# Altium schematic sheet P15_4G_5G_NVME.SchDoc
size 594 x 420 mm
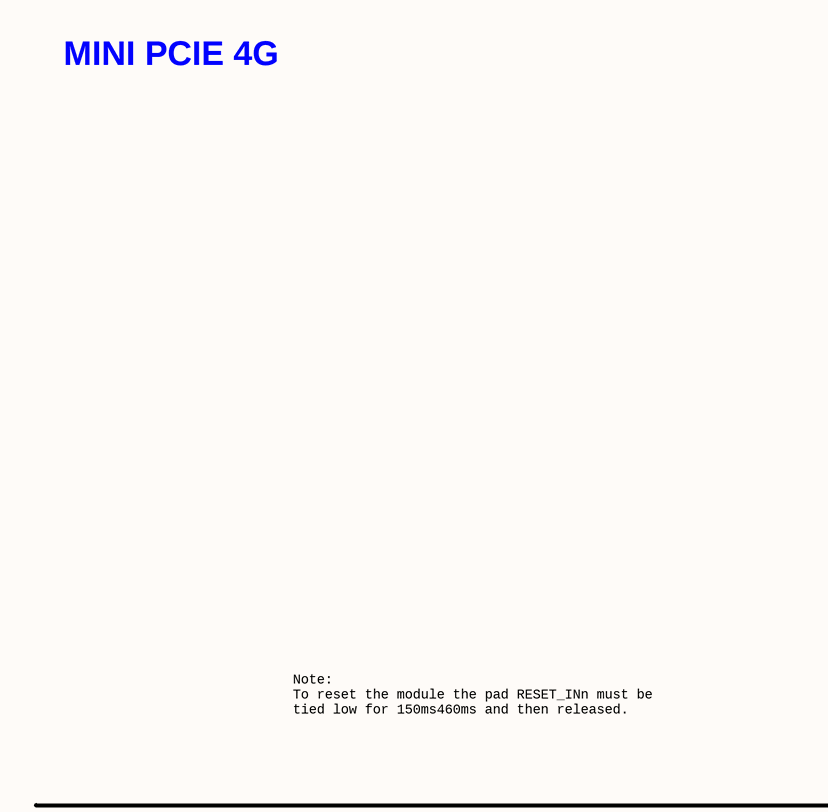
[diagram p0: P15_4G_5G_NVME.SchDoc, top left]
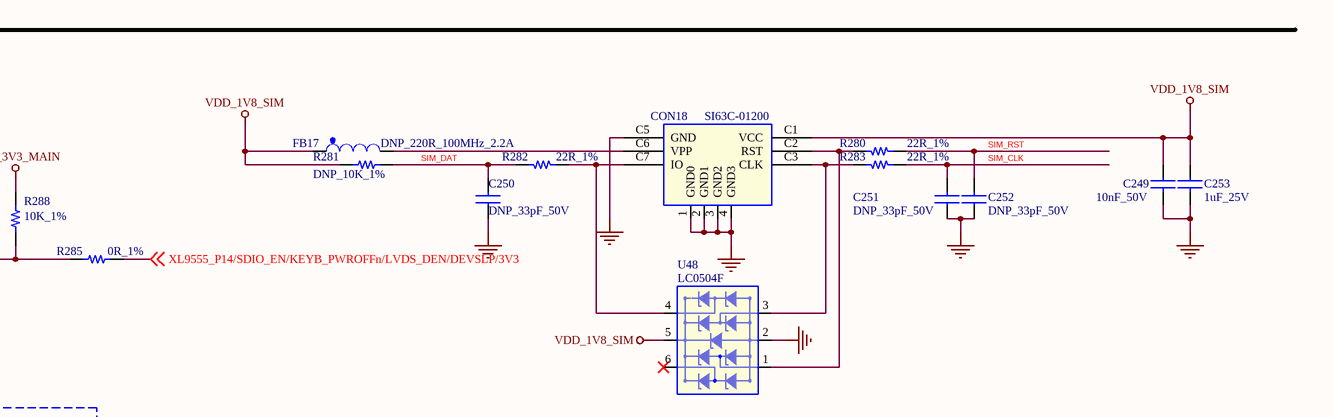
[diagram p1: P15_4G_5G_NVME.SchDoc, top right]
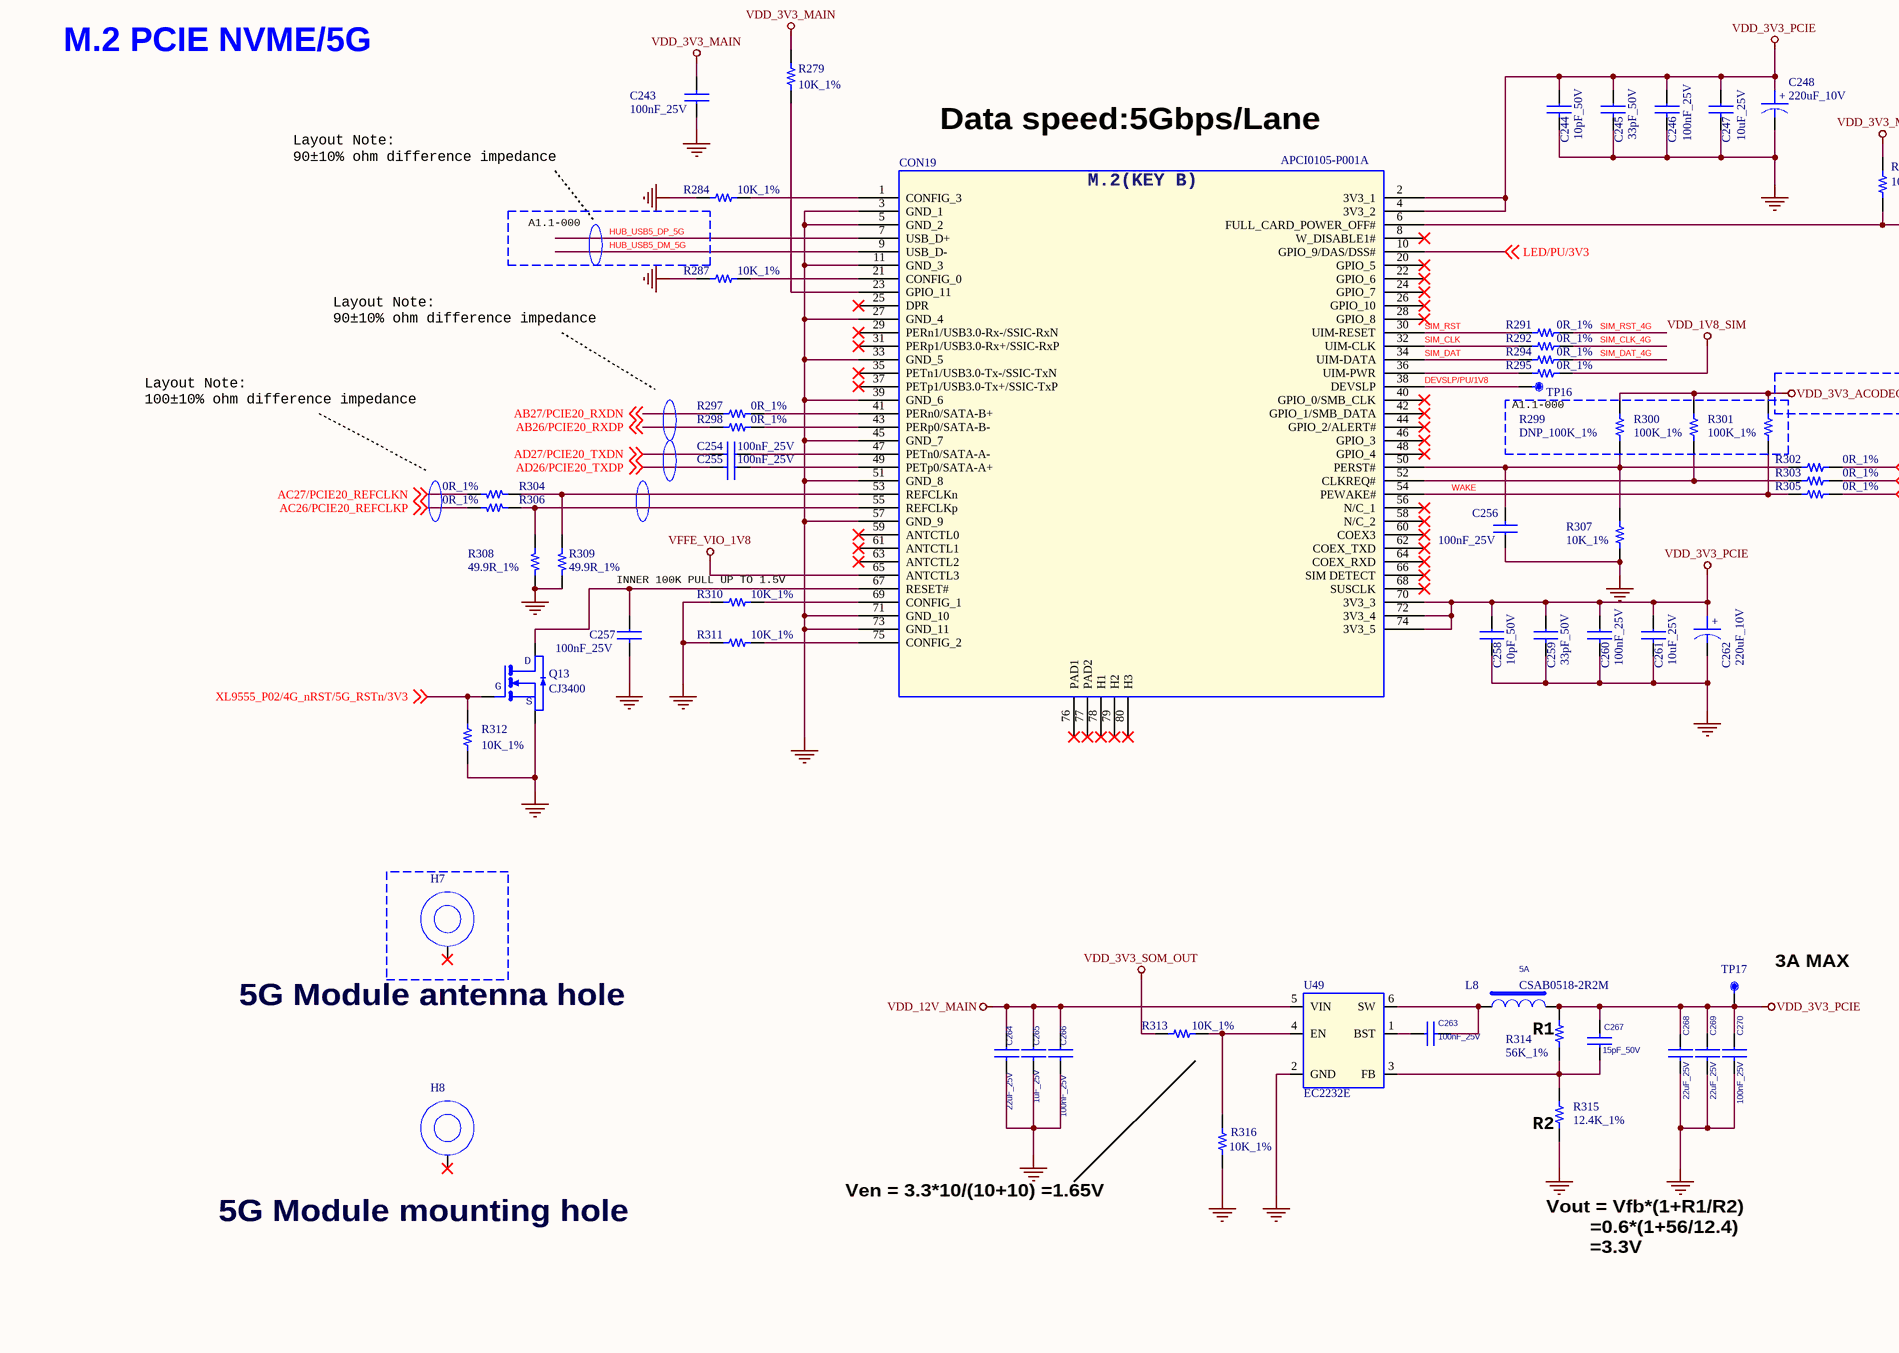
[diagram p2: P15_4G_5G_NVME.SchDoc, bottom left]
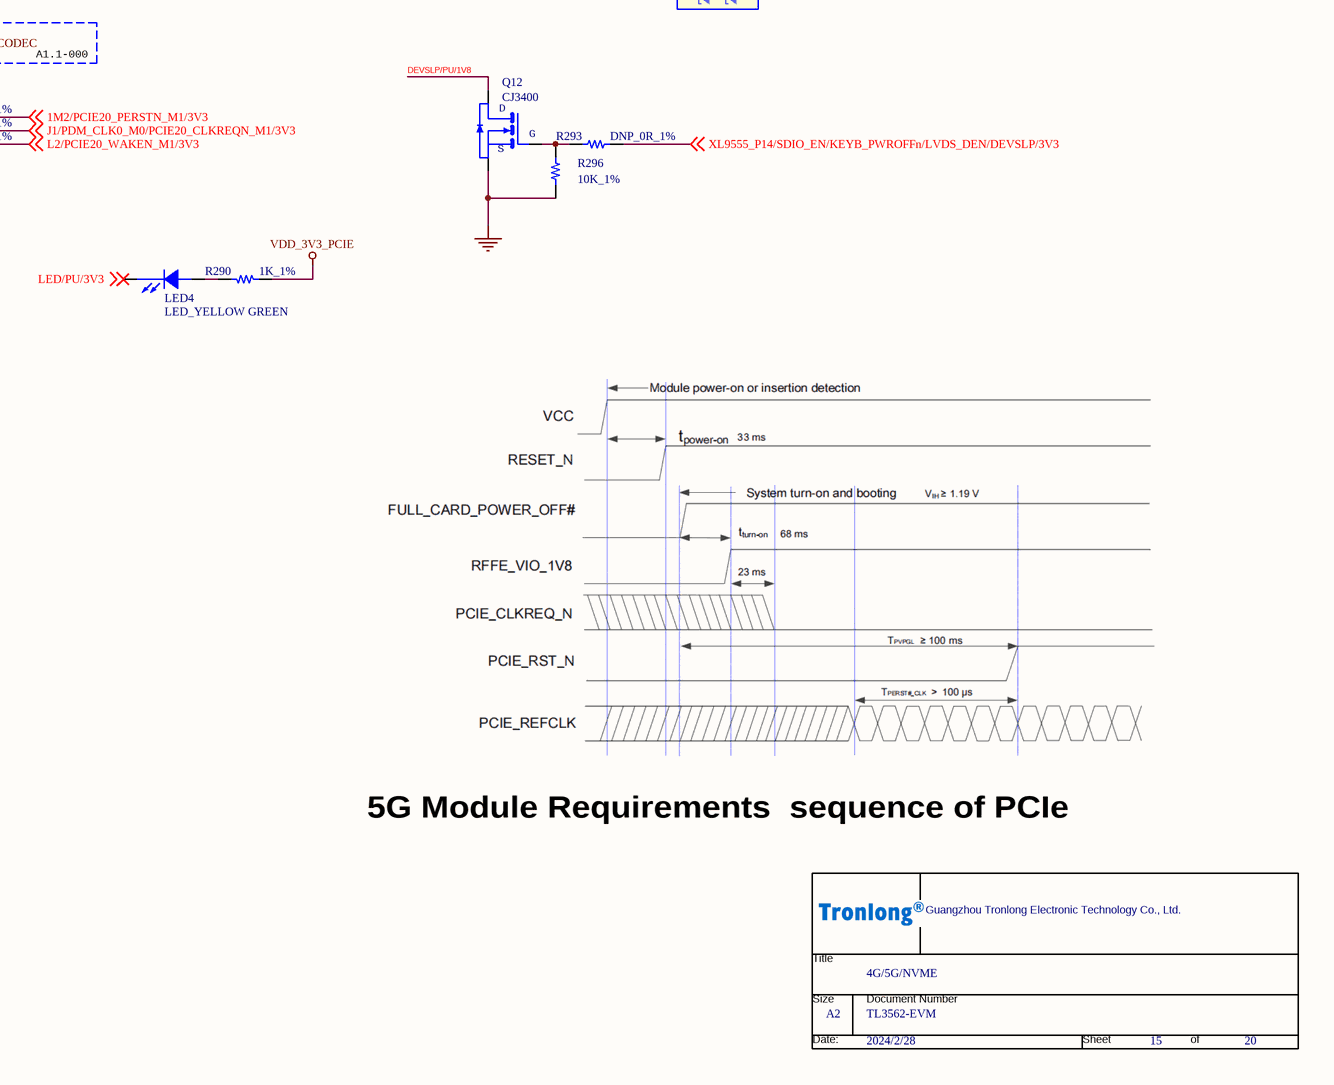
[diagram p3: P15_4G_5G_NVME.SchDoc, bottom right]

## Parts
*  Page Count: 20  Page Number: 15  Page Size: A2  OrgName: Guangzhou Tronlong Electronic Technology Co., Ltd.  Title: 4G/5G/NVME  Doc: TL3562-EVM  Page Modify Date: 2024/2/28  (hidden comment: Tronlong_TITTLE_20211115)  (graphical)
C243  100nF_25V  [C0402]
C244  10pF_50V  [C0603]
C245  33pF_50V  [C0603]
C246  100nF_25V  [C0402]
C247  10uF_25V  [C0603]
C248  220uF_10V  [CAP_CASE_D]
C249  10nF_50V  [C0402]
C250  DNP_33pF_50V  [C0603]
C251  DNP_33pF_50V  [C0603]
C252  DNP_33pF_50V  [C0603]
C253  1uF_25V  [C0603]
C254  100nF_25V  [C0402]
C255  100nF_25V  [C0402]
C256  100nF_25V  [C0402]
C257  100nF_25V  [C0402]
C258  10pF_50V  [C0603]
C259  33pF_50V  [C0603]
C260  100nF_25V  [C0402]
C261  10uF_25V  [C0603]
C262  220uF_10V  [CAP_CASE_D]
C263  100nF_25V  [C0402]
C264  22uF_25V  [C0805]
C265  1uF_25V  [C0603]
C266  100nF_25V  [C0402]
C267  15pF_50V  [C0402]
C268  22uF_25V  [C0805]
C269  22uF_25V  [C0805]
C270  100nF_25V  [C0402]
CON18  SI63C-01200  [micro-sim]
CON19  APCI0105-P001A  [conn-smd_apci0103-p001a]
FB17  DNP_220R_100MHz_2.2A  [L0603]
H7  HOLE  [NHOLE_C4_BT]  (value not drawn)
H8  HOLE  [5G_HOLE_3D5]  (value not drawn)
L8  CSAB0518-2R2M  Current: 5A  [SMD_CSAB0518]
LED4  LED_YELLOW GREEN  [D0603]
Q12  CJ3400  [SOT23-3_DBZ3]
Q13  CJ3400  [SOT23-3_DBZ3]
R279  10K_1%  [R0402]
R280  22R_1%  [R0402]
R281  DNP_10K_1%  [R0402]
R282  22R_1%  [R0402]
R283  22R_1%  [R0402]
R284  10K_1%  [R0402]
R285  0R_1%  [R0402]
R287  10K_1%  [R0402]
R288  10K_1%  [R0402]
R290  1K_1%  [R0402]
R291  0R_1%  [R0402]
R292  0R_1%  [R0402]
R293  DNP_0R_1%  [R0402]
R294  0R_1%  [R0402]
R295  0R_1%  [R0603]
R296  10K_1%  [R0402]
R297  0R_1%  [R0402]
R298  0R_1%  [R0402]
R299  DNP_100K_1%  [R0402]
R300  100K_1%  [R0402]
R301  100K_1%  [R0402]
R302  0R_1%  [R0402]
R303  0R_1%  [R0402]
R304  0R_1%  [R0402]
R305  0R_1%  [R0402]
R306  0R_1%  [R0402]
R307  10K_1%  [R0402]
R308  49.9R_1%  [R0603]
R309  49.9R_1%  [R0603]
R310  10K_1%  [R0402]
R311  10K_1%  [R0402]
R312  10K_1%  [R0402]
R313  10K_1%  [R0402]
R314  56K_1%  [R0402]
R315  12.4K_1%  [R0402]
R316  10K_1%  [R0402]
TP16  SMT TP  [TP-S40]  (value not drawn)
TP17  SMT TP  [TP-S40]  (value not drawn)
U48  LC0504F  [SOT363]
U49  EC2232E  [SOT-23-6L]

## Blocks framed on the sheet
A1.1-000: R299-R301

## Nets
GND: C243.1 C244.2 C245.2 C246.2 C247.2 C248.2 C249.2 C250.1 C251.1 C252.1 C253.2 C256.1 C257.2 C258.2 C259.2 C260.2 C261.2 C262.2 C264.2 C265.2 C266.2 C268.2 C269.2 C270.2 CON18.1(GND0) CON18.2(GND1) CON18.3(GND2) CON18.4(GND3) CON18.C5(GND) CON19.3(GND_1) CON19.5(GND_2) CON19.11(GND_3) CON19.27(GND_4) CON19.33(GND_5) CON19.39(GND_6) CON19.45(GND_7) CON19.51(GND_8) CON19.57(GND_9) CON19.71(GND_10) CON19.73(GND_11) Q12.2(E) Q13.2(E) R284.2 R287.2 R296.2 R307.2 R308.1 R309.1 R310.2 R311.2 R312.2 R315.1 R316.1 U48.2 U49.2(GND)
VDD_1V8_SIM: C249.1 C253.1 CON18.C1(VCC) FB17.1 R281.1 R295.1 U48.5
VDD_3V3_ACODEC: R299.1 R300.1 R301.1
VDD_3V3_MAIN: C243.2 R279.1 R288.1
VDD_3V3_PCIE: C244.1 C245.1 C246.1 C247.1 C248.1 C258.1 C259.1 C260.1 C261.1 C262.1 C267.2 C268.1 C269.1 C270.1 CON19.2(3V3_1) CON19.4(3V3_2) CON19.70(3V3_3) CON19.72(3V3_4) CON19.74(3V3_5) L8.2 R290.1 R314.2 TP17.1
VDD_3V3_SOM_OUT: R313.2
VDD_12V_MAIN: C264.1 C265.1 C266.1 U49.5(VIN)
VFFE_VIO_1V8: CON19.65(ANTCTL3)
1M2/PCIE20_PERSTN_M1/3V3: R302.1 ; off-sheet 1M2/PCIE20_PERSTN_M1/3V3
AB26/PCIE20_RXDP: R298.1 ; off-sheet AB26/PCIE20_RXDP
AB27/PCIE20_RXDN: R297.1 ; off-sheet AB27/PCIE20_RXDN
AC26/PCIE20_REFCLKP: R306.2 ; off-sheet AC26/PCIE20_REFCLKP
AC27/PCIE20_REFCLKN: R304.2 ; off-sheet AC27/PCIE20_REFCLKN
AD26/PCIE20_TXDP: C255.2 ; off-sheet AD26/PCIE20_TXDP
AD27/PCIE20_TXDN: C254.2 ; off-sheet AD27/PCIE20_TXDN
DEVSLP/PU/1V8: CON19.38(DEVSLP) Q12.3(C) TP16.1
HUB_USB5_DM_5G: CON19.9(USB_D-)
HUB_USB5_DP_5G: CON19.7(USB_D+)
J1/PDM_CLK0_M0/PCIE20_CLKREQN_M1/3V3: R303.1 ; off-sheet J1/PDM_CLK0_M0/PCIE20_CLKREQN_M1/3V3
L2/PCIE20_WAKEN_M1/3V3: R305.1 ; off-sheet L2/PCIE20_WAKEN_M1/3V3
LED/PU/3V3: CON19.10(GPIO_9/DAS/DSS#) LED4.2(ANODE) ; off-sheet LED/PU/3V3
SIM_CLK: C251.2 CON19.32(UIM-CLK) R283.2 R292.2
SIM_CLK_4G: R292.1
SIM_DAT: C250.2 CON19.34(UIM-DATA) R281.2 R282.1 R294.2
SIM_DAT_4G: R294.1
SIM_RST: C252.2 CON19.30(UIM-RESET) R280.2 R291.2
SIM_RST_4G: R291.1
WAKE: CON19.54(PEWAKE#) R301.2 R305.2
XL9555_P02/4G_nRST/5G_RSTn/3V3: Q13.1(B) R312.1 ; off-sheet XL9555_P02/4G_nRST/5G_RSTn/3V3
XL9555_P14/SDIO_EN/KEYB_PWROFFn/LVDS_DEN/DEVSLP/3V3: R285.1 R293.2 ; off-sheet XL9555_P14/SDIO_EN/KEYB_PWROFFn/LVDS_DEN/DEVSLP/3V3
NetC254_1: C254.1 CON19.47(PETn0/SATA-A-)
NetC255_1: C255.1 CON19.49(PETp0/SATA-A+)
NetC256_2: C256.2 CON19.50(PERST#) R299.2 R302.2 R307.1
NetC257_1: C257.1 CON19.67(RESET#) Q13.3(C)
NetC263_1: C263.1 U49.1(BST)
NetC263_2: C263.2 L8.1 U49.6(SW)
NetC267_1: C267.1 R314.1 R315.2 U49.3(FB)
NetCON18_C2: CON18.C2(RST) R280.1 U48.1
NetCON18_C3: CON18.C3(CLK) R283.1 U48.3
NetCON18_C6: CON18.C6(VPP) FB17.2
NetCON18_C7: CON18.C7(IO) R282.2 U48.4
NetCON19_1: CON19.1(CONFIG_3) R284.1
NetCON19_6: CON19.6(FULL_CARD_POWER_OFF#) R285.2 R288.2
NetCON19_21: CON19.21(CONFIG_0) R287.1
NetCON19_23: CON19.23(GPIO_11) R279.2
NetCON19_36: CON19.36(UIM-PWR) R295.2
NetCON19_41: CON19.41(PERn0/SATA-B+) R297.2
NetCON19_43: CON19.43(PERp0/SATA-B-) R298.2
NetCON19_52: CON19.52(CLKREQ#) R300.2 R303.2
NetCON19_53: CON19.53(REFCLKn) R304.1 R309.2
NetCON19_55: CON19.55(REFCLKp) R306.1 R308.2
NetCON19_69: CON19.69(CONFIG_1) R310.1
NetCON19_75: CON19.75(CONFIG_2) R311.1
NetLED4_1: LED4.1(CATHODE) R290.2
NetQ12_1: Q12.1(B) R293.1 R296.1
NetR313_1: R313.1 R316.2 U49.4(EN)

Not connected (* = marked no-connect by the designer): CON19 8(W_DISABLE1#)* 20(GPIO_5)* 22(GPIO_6)* 24(GPIO_7)* 25(DPR)* 26(GPIO_10)* 28(GPIO_8)* 29(PERn1/USB3.0-Rx-/SSIC-RxN)* 31(PERp1/USB3.0-Rx+/SSIC-RxP)* 35(PETn1/USB3.0-Tx-/SSIC-TxN)* 37(PETp1/USB3.0-Tx+/SSIC-TxP)* 40(GPIO_0/SMB_CLK)* 42(GPIO_1/SMB_DATA)* 44(GPIO_2/ALERT#)* 46(GPIO_3)* 48(GPIO_4)* 56(N/C_1)* 58(N/C_2)* 59(ANTCTL0)* 60(COEX3)* 61(ANTCTL1)* 62(COEX_TXD)* 63(ANTCTL2)* 64(COEX_RXD)* 66(SIM_DETECT)* 68(SUSCLK)* 76(PAD1)* 77(PAD2)* 78(H1)* 79(H2)* 80(H3)*; H7 1*; H8 1*; U48 6*

## Notes on the sheet
- MINI PCIE 4G
- Note:
  To reset the module the pad RESET_INn must be
  tied low for 150ms460ms and then released.
- M.2 PCIE NVME/5G
- Layout Note:
  90±10% ohm difference impedance
- Data speed:5Gbps/Lane
- A1.1-000
- Layout Note:
  100±10% ohm difference impedance
- (near R310) INNER 100K PULL UP TO 1.5V
- (near H7) 5G Module antenna hole
- R1
- (near TP17) 3A MAX
- (near R315) R2
- (near *) 5G Module Requirements  sequence of PCIe
- (near H8) 5G Module mounting hole
- Ven = 3.3*10/(10+10) =1.65V
- Vout = Vfb*(1+R1/R2)
  =0.6*(1+56/12.4)
  =3.3V
- (in symbol CAP POL_Dup1) +
- (in symbol CON_M_1) M.2(KEY B)
- (in symbol MMBT3904/SOT_1) D; G; S
- (in symbol MOSFET N SOT) D; G; S
- (in symbol Tronlong_TITTLE_20211115) Title; Size; Document Number; Date:; Sheet; of

## Library data of the parts
* = Tronlong_TITTLE_20211115: RevCode: A?; Page Create Date: March  8, 1995
C243 C256 = CAP NP_Dup3: 贴片陶瓷电容,100nF,10%,25V,X5R; Manufacturer Character: 中国大陆; room: USB HUB; Operation Temperature（℃）: -55~85℃; As-Welded: /; PCB Footprint: C0402
C244 = CAP NP_Dup3: 贴片陶瓷电容,10pF,5%,50V,COG; Manufacturer Character: 中国大陆; Operation Temperature（℃）: -55~125℃; As-Welded: /; PCB Footprint: C0603; Temperature: -55~125℃
C245 = CAP NP_Dup3: 贴片陶瓷电容,33pF,5%,50V,COG; Manufacturer Character: 中国大陆; Operation Temperature（℃）: -55~125℃; As-Welded: /; PCB Footprint: C0603; Temperature: -55~125℃
C246 C263 C266 C270 = CAP NP_Dup3: 贴片陶瓷电容,100nF,10%,25V,X5R; Manufacturer Character: 中国大陆; Operation Temperature（℃）: -55~85℃; As-Welded: /; PCB Footprint: C0402; Temperature: -55~125℃
C247 = CAP NP_Dup3: 贴片陶瓷电容,10uF,10%,10V,X5R; Manufacturer Character: 中国大陆; As-Welded: /; Operation Temperature（℃）: -55~85℃; room: 6; PCB Footprint: C0603; Temperature: -55~125℃
C248 = CAP POL_Dup1: D型钽电容,220uF,10%,10V; Manufacturer PartNumber: CA45-D010K227T; Manufacturer: 湖南湘怡中元科技有限公司（XIANGYEE）; Manufacturer Character: 中国大陆; As-Welded: /; Operation Temperature（℃）: -55~125℃; PCB Footprint: CAP_CASE_D; Temperature: -55~125℃
C249 = CAP NP_Dup3: 贴片陶瓷电容,10nF,10%,50V,X7R; Manufacturer Character: 中国大陆; Operation Temperature（℃）: -55~125℃; As-Welded: /; PCB Footprint: C0402; Temperature: –55~125℃
C250 = CAP NP_Dup3: 贴片陶瓷电容,33pF,5%,50V,COG; Manufacturer Character: 中国大陆; Operation Temperature（℃）: -55~125℃; As-Welded: DNP; PCB Footprint: C0603; Temperature: -55~155℃
C251 C252 = CAP NP_Dup3: 贴片陶瓷电容,33pF,5%,50V,COG; Manufacturer Character: 中国大陆; As-Welded: DNP; Operation Temperature（℃）: -55~125℃; PCB Footprint: C0603; Temperature: -55~155℃
C253 C265 = CAP NP_Dup3: 贴片陶瓷电容,1uF,10%,25V,X5R; Manufacturer Character: 中国大陆; Operation Temperature（℃）: -55~85℃; As-Welded: /; PCB Footprint: C0603
C254 C255 C257 C260 = CAP NP_Dup3: 贴片陶瓷电容,100nF,10%,25V,X5R; Manufacturer Character: 中国大陆; As-Welded: /; Operation Temperature（℃）: -55~85℃; PCB Footprint: C0402; Temperature: -55~125℃
C258 = CAP NP_Dup3: 贴片陶瓷电容,10pF,5%,50V,COG; Manufacturer Character: 中国大陆; As-Welded: /; Operation Temperature（℃）: -55~125℃; PCB Footprint: C0603; Temperature: -55~125℃
C259 = CAP NP_Dup3: 贴片陶瓷电容,33pF,5%,50V,COG; Manufacturer Character: 中国大陆; As-Welded: /; Operation Temperature（℃）: -55~125℃; PCB Footprint: C0603; Temperature: -55~125℃
C261 = CAP NP_Dup3: 贴片陶瓷电容,10uF,10%,10V,X5R; Manufacturer Character: 中国大陆; Operation Temperature（℃）: -55~85℃; room: 6; As-Welded: /; PCB Footprint: C0603; Temperature: -55~125℃
C262 = CAP POL_Dup1: D型钽电容,220uF,10%,10V; Manufacturer Character: 中国大陆; Manufacturer PartNumber: CA45-D010K227T; Manufacturer: 湖南湘怡中元科技有限公司（XIANGYEE）; Operation Temperature（℃）: -55~125℃; As-Welded: /; PCB Footprint: CAP_CASE_D; Temperature: -55~125℃
C264 C268 = CAP NP_Dup3: 贴片陶瓷电容,22uF,20%,25V,X5R; Manufacturer Character: 中国大陆; As-Welded: /; Operation Temperature（℃）: -55~85℃; PCB Footprint: C0805; Temperature: -55~125℃
C267 = CAP NP_Dup3: 贴片陶瓷电容,15pF,5%,50V,COG; Manufacturer Character: 中国大陆; As-Welded: /; Operation Temperature（℃）: -55~125℃; Temperature: -55~125℃; PCB Footprint: C0402
C269 = CAP NP_Dup3: 贴片陶瓷电容,22uF,20%,25V,X5R; Manufacturer Character: 中国大陆; Operation Temperature（℃）: -55~85℃; As-Welded: /; PCB Footprint: C0805; Temperature: -55~125℃
CON18 = SIM_CARD_2: Micro SIM卡座,6P,自弹; Manufacturer: 深圳市爱特姆科技有限公司( ATOM); Manufacturer Character: 中国大陆; As-Welded: /; Manufacturer PartNumber: SI63C-01200; Temperature: -40~85℃; PCB Footprint: micro-sim
CON19 = CON_M_1: NGFF（M.2）金手指连接器，KEY B,高4.2mm; Manufacturer: 深圳市连欣科技有限公司; Manufacturer Character: 中国大陆; As-Welded: /; PCB Footprint: conn-smd_apci0103-p001a; Manufacturer PartNumber: APCI0105-P001A
FB17 = FB_0: 磁珠,50mΩ,2.2A,220R@100MHz; Manufacturer Character: 中国大陆; Manufacturer: 深圳顺络电子股份有限公司（Sunlord）; Manufacturer PartNumber: UPZ1608U221-2R2TF; room: 6; As-Welded: DNP; Operation Temperature（℃）: -55~125℃; Temperature: -55~125℃; PCB Footprint: L0603
H7 H8 = HOLE: Manufacturer Character: 中国大陆; As-Welded: /
  H7: PCB Footprint: NHOLE_C4_BT
  H8: PCB Footprint: 5G_HOLE_3D5
L8 = INDUCTOR: 贴片功率电感,2.2uH,0.035Ω,Isat=6.5A,Irms=5A; Manufacturer: 深圳市科达嘉电子有限公司（CODACA）; Manufacturer Character: 中国大陆; Parameter: L2520，奇力新一体成型电感，最大额定电流3A，内阻65毫欧，20%; As-Welded: /; Operation Temperature（℃）: -40~125℃; Manufacturer PartNumber: CSAB0518-2R2M; Temperature: -40~125℃; PCB Footprint: SMD_CSAB0518
LED4 = LED_0: 贴片式发光二极管,黄绿色,普亮; Manufacturer Character: 中国大陆; Manufacturer: 东莞市亿晶源光电科技有限公司（ekinglux）; Manufacturer PartNumber: E6C0603YGAC1UDA; As-Welded: /; Operation Temperature（℃）: -40~90℃; PCB Footprint: D0603; Temperature: -55~85℃
Q12 = MMBT3904/SOT_1: MOSFET,N沟道,VDSS=30V,VGSS=±12V,ID=5.8A,PD=0.35W,VGS(th)=1.4V; Manufacturer: 江苏长晶科技股份有限公司（JSCJ）; Manufacturer Character: 中国大陆; As-Welded: /; Operation Temperature（℃）: -55~150℃; ROOM: DSP_LED; PCB Footprint: SOT23-3_DBZ3; Manufacturer PartNumber: CJ3400
Q13 = MOSFET N SOT: MOSFET,N沟道,VDSS=30V,VGSS=±12V,ID=5.8A,PD=0.35W,VGS(th)=1.4V; Manufacturer: 江苏长晶科技股份有限公司（JSCJ）; Manufacturer Character: 中国大陆; Operation Temperature（℃）: -55~150℃; ROOM: DSP_LED; As-Welded: /; PCB Footprint: SOT23-3_DBZ3; Manufacturer PartNumber: CJ3400; Temperature: -55~150℃
R279 R310-R312 = Resistor_Dup3: 贴片电阻,10K,±1%,1/16W; Manufacturer Character: 中国大陆; CLASS: DISCRETE; room: USB HUB; Operation Temperature（℃）: -55~155℃; As-Welded: /; PCB Footprint: R0402
R280 R282 R283 = Resistor_Dup3: 贴片电阻,22R,±1%,1/16W; Manufacturer Character: 中国大陆; CLASS: DISCRETE; As-Welded: /; Operation Temperature（℃）: -55~155℃; PCB Footprint: R0402; Temperature: -55~155℃
R281 = Resistor_Dup3: 贴片电阻,10K,±1%,1/16W; Manufacturer Character: 中国大陆; CLASS: DISCRETE; Operation Temperature（℃）: -55~155℃; As-Welded: DNP; PCB Footprint: R0402; Temperature: -55~155℃
R284 R296 R307 = Resistor_Dup3: 贴片电阻,10K,±1%,1/16W; Manufacturer Character: 中国大陆; CLASS: DISCRETE; As-Welded: /; Operation Temperature（℃）: -55~155℃; room: USB HUB; PCB Footprint: R0402
R285 R291 R292 R294 = Resistor_Dup3: 贴片电阻,0R,±1%,1/16W; Manufacturer Character: 中国大陆; CLASS: DISCRETE; Operation Temperature（℃）: -55~155℃; As-Welded: /; PCB Footprint: R0402
R287 = Resistor_Dup3: 贴片电阻,10K,±1%,1/16W; Manufacturer Character: 中国大陆; CLASS: DISCRETE; Operation Temperature（℃）: -55~155℃; room: USB HUB; As-Welded: /; PCB Footprint: R0402
R288 = Resistor_Dup3: 贴片电阻,10K,±1%,1/16W; Manufacturer Character: 中国大陆; CLASS: DISCRETE; As-Welded: /; room: USB HUB; Operation Temperature（℃）: -55~155℃; PCB Footprint: R0402
R290 = R 1%: 贴片电阻,1K,±1%,1/16W; Manufacturer Character: 中国大陆; Characteristic: 0402 1/16W +/-1%; CLASS: DISCRETE; As-Welded: /; Operation Temperature（℃）: -55~155℃; PCB Footprint: R0402; Temperature: -55~155℃
R293 = Resistor_Dup3: 贴片电阻,0R,±1%,1/16W; Manufacturer Character: 中国大陆; CLASS: DISCRETE; As-Welded: DNP; Operation Temperature（℃）: -55~155℃; PCB Footprint: R0402
R295 = Resistor_Dup3: 贴片电阻,0R,±1%,1/10W; Manufacturer Character: 中国大陆; CLASS: DISCRETE; As-Welded: /; Operation Temperature（℃）: -55~155℃; PCB Footprint: R0603
R297 R302 R303 R305 = Resistor_Dup3: 贴片电阻,0R,±1%,1/16W; Manufacturer Character: 中国大陆; CLASS: DISCRETE; As-Welded: /; Operation Temperature（℃）: -55~155℃; room: USB HUB; PCB Footprint: R0402
R298 = Resistor_Dup3: 贴片电阻,0R,±1%,1/16W; Manufacturer Character: 中国大陆; CLASS: DISCRETE; As-Welded: /; room: USB HUB; Operation Temperature（℃）: -55~155℃; PCB Footprint: R0402
R299 = Resistor_Dup3: 贴片电阻,100K,±1%,1/16W; Manufacturer Character: 中国大陆; CLASS: DISCRETE; Operation Temperature（℃）: -55~155℃; room: USB HUB; As-Welded: DNP; PCB Footprint: R0402
R300 = Resistor_Dup3: 贴片电阻,100K,±1%,1/16W; Manufacturer Character: 中国大陆; CLASS: DISCRETE; As-Welded: /; room: USB HUB; Operation Temperature（℃）: -55~155℃; PCB Footprint: R0402
R301 = Resistor_Dup3: 贴片电阻,100K,±1%,1/16W; Manufacturer Character: 中国大陆; CLASS: DISCRETE; Operation Temperature（℃）: -55~155℃; room: USB HUB; As-Welded: /; PCB Footprint: R0402
R304 R306 = Resistor_Dup3: 贴片电阻,0R,±1%,1/16W; Manufacturer Character: 中国大陆; CLASS: DISCRETE; As-Welded: /; Operation Temperature（℃）: -55~155℃; PCB Footprint: R0402
R308 = Resistor_Dup3: 贴片电阻,49.9R,±1%,1/10W; Manufacturer Character: 中国大陆; CLASS: DISCRETE; As-Welded: /; Operation Temperature（℃）: -55~125℃; PCB Footprint: R0603
R309 = Resistor_Dup3: 贴片电阻,49.9R,±1%,1/10W; Manufacturer Character: 中国大陆; CLASS: DISCRETE; Operation Temperature（℃）: -55~125℃; As-Welded: /; PCB Footprint: R0603
R313 R316 = Resistor_Dup3: 贴片电阻,10K,±1%,1/16W; Manufacturer Character: 中国大陆; CLASS: DISCRETE; As-Welded: /; Operation Temperature（℃）: -55~155℃; PCB Footprint: R0402; Temperature: –55~155℃
R314 = Resistor_Dup3: 贴片电阻,56K,±1%,1/16W; Manufacturer Character: 中国大陆; CLASS: DISCRETE; Operation Temperature（℃）: -55~155℃; As-Welded: /; PCB Footprint: R0402; Temperature: -55~155℃
R315 = Resistor_Dup3: 贴片电阻,12.4K,±1%,1/16W; Manufacturer Character: 中国大陆; CLASS: DISCRETE; As-Welded: /; Operation Temperature（℃）: -55~155℃; PCB Footprint: R0402; Temperature: -55~155℃
TP16 = TP-S40: Manufacturer Character: 中国大陆; Characteristic: Test point,diameter=1.0mm; As-Welded: /; room: USB HUB; PCB Footprint: TP30
TP17 = TP-S40: Manufacturer Character: 中国大陆; Characteristic: Test point,diameter=1.0mm; PCB Footprint: TP30; As-Welded: /
U48 = PRTR5V0U4Y_0: ESD二极管,VRWM=5V,VBR=6V,四组,单向,8KV,15KV; Manufacturer: 上海雷卯电子科技有限公司（Leiditech）; Manufacturer Character: 中国大陆; As-Welded: /; room: SD; Operation Temperature（℃）: -55~125℃; Temperature: -40~85℃; Manufacturer PartNumber: LC0504F; Manufacturer Part Number: PRTR5V0U4Y; PCB Footprint: SOT363
U49 = WD1304E30: DC/DC,Buck,Vin:4.5V~17V,Vout:0.6V~6V,3A,1路; Manufacturer: 上海芯强微电子股份有限公司（Ecranic）; Manufacturer Character: 中国大陆; As-Welded: /; Operation Temperature（℃）: -40~85℃; Temperature: -40~85℃; Manufacturer PartNumber: EC2232E; PCB Footprint: SOT-23-6L